# Altium schematic sheet Fatigue_V1.00.SchDoc
size A3
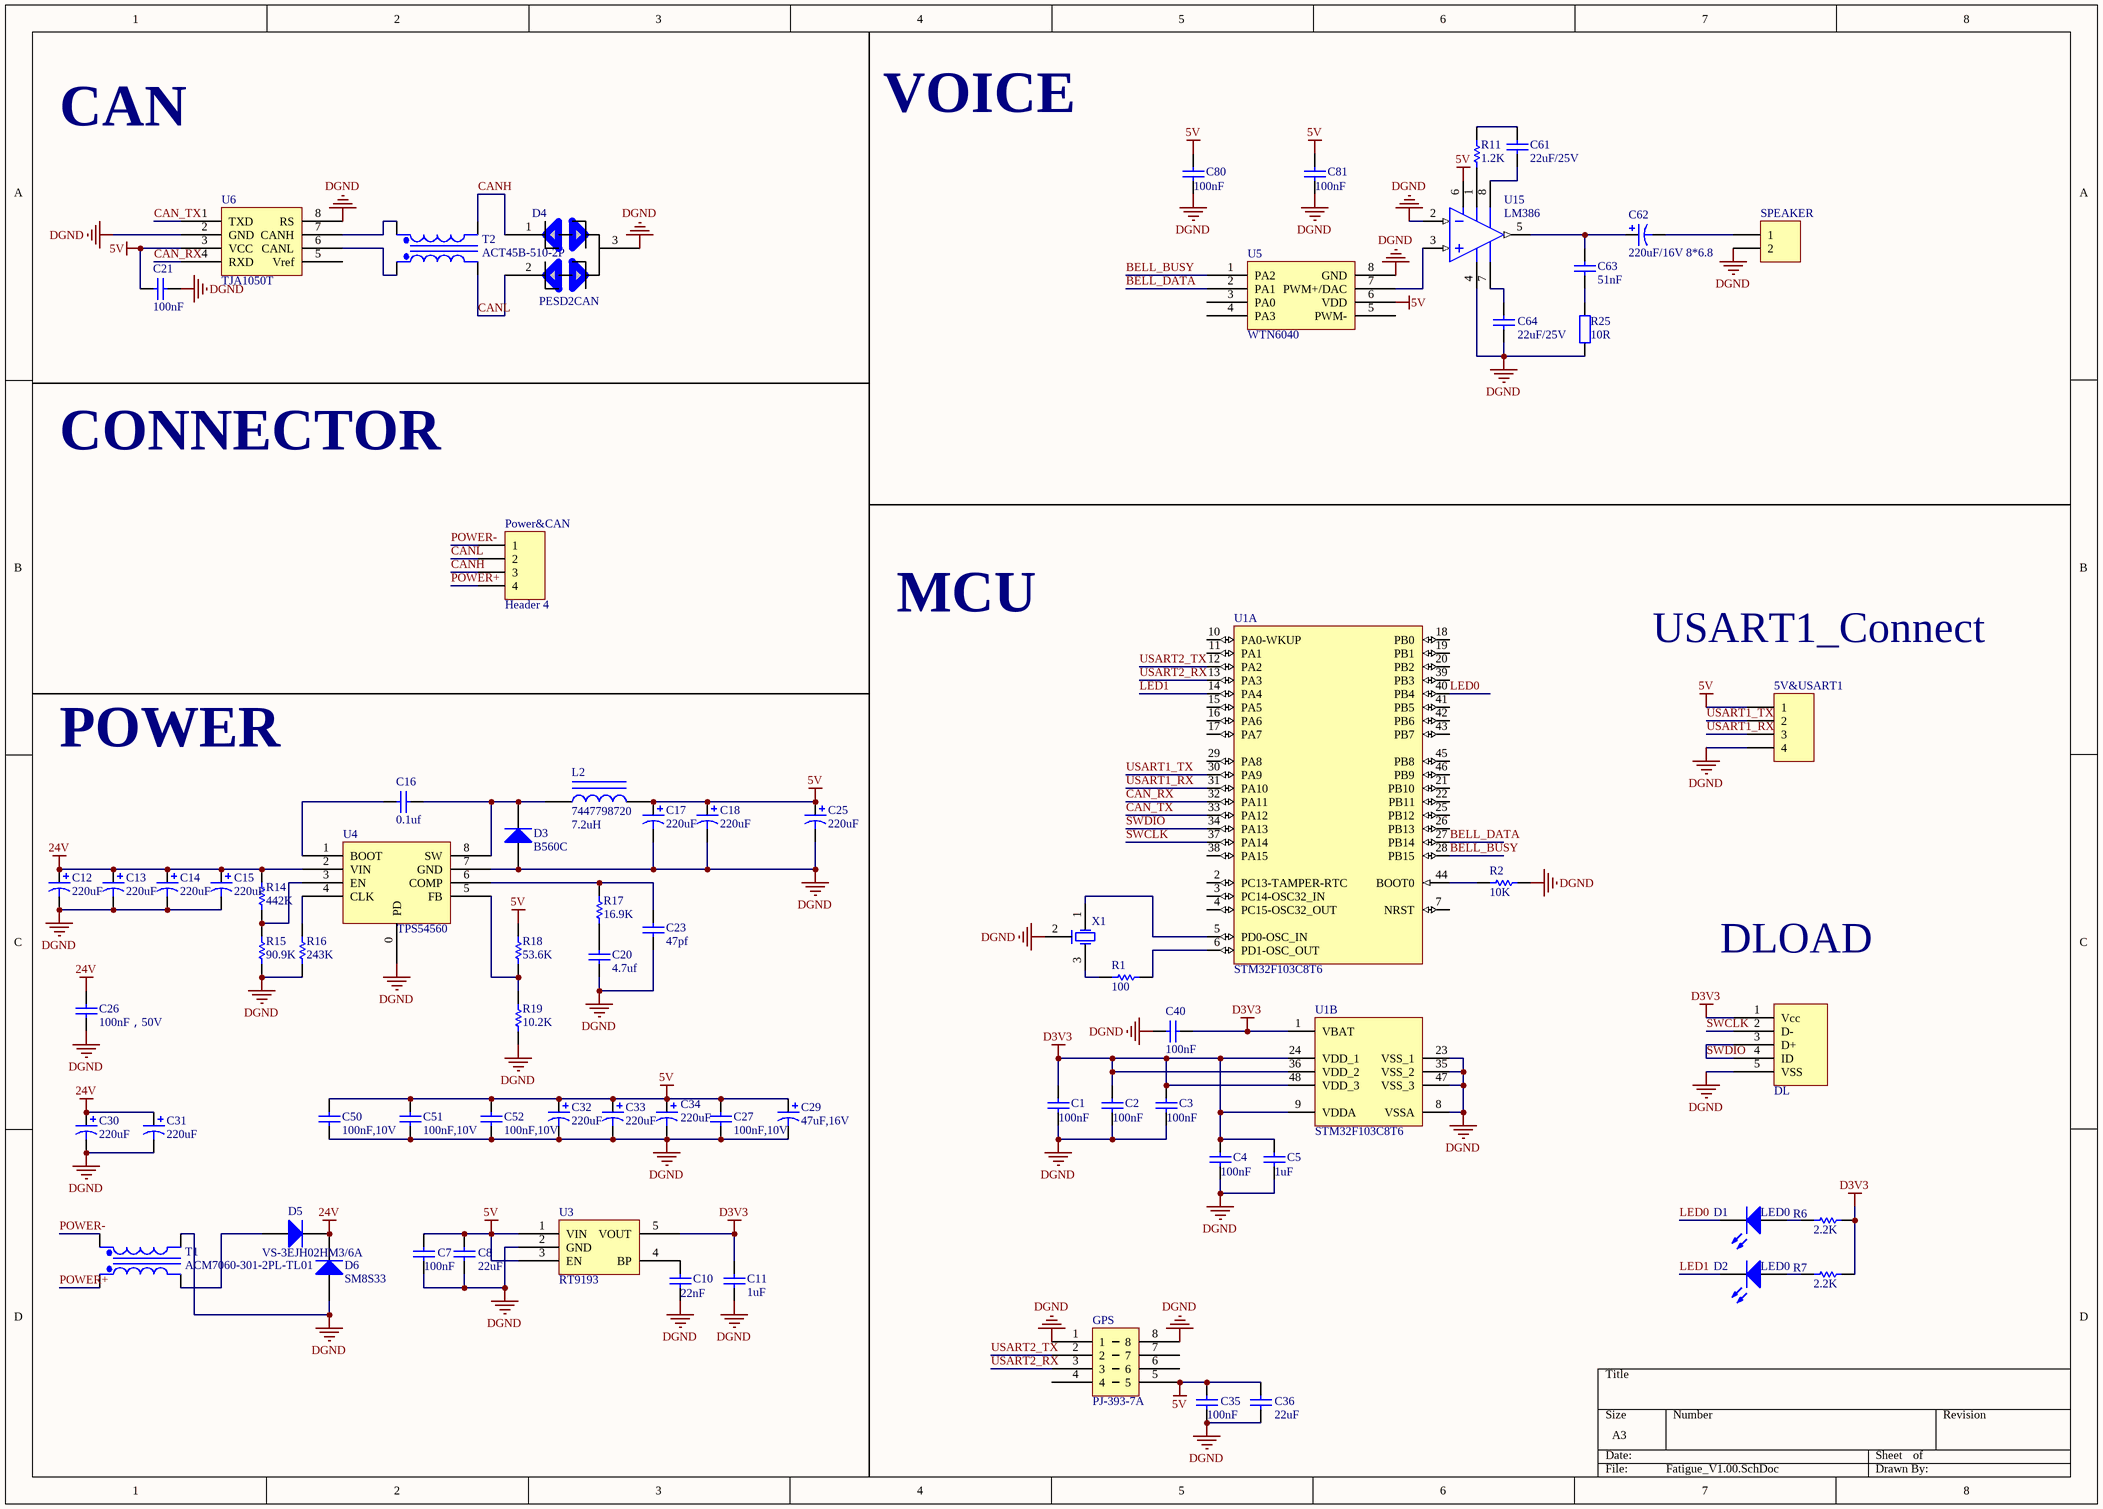
[diagram p0: Fatigue_V1.00.SchDoc]

## Parts
5V&USART1  TEST_USART2  [HDR1X4]  (value not drawn)
C1  100nF  [0402]
C2  100nF  [0402]
C3  100nF  [0402]
C4  100nF  [0402]
C5  1uF  [0603]
C7  100nF  [0402]
C8  22uF  [0805]
C10  22nF  [0402]
C11  1uF  [0603]
C12  220uF  [cap_pol_8*10.2]
C13  220uF  [cap_pol_8*10.2]
C14  220uF  [cap_pol_8*10.2]
C15  220uF  [cap_pol_8*10.2]
C16  0.1uf  [0603]
C17  220uF  [cap_pol_8*10.2]
C18  220uF  [cap_pol_8*10.2]
C20  4.7uf  [0603]
C21  100nF  [0402]
C23  47pf  [0603]
C25  220uF  [cap_pol_8*10.2]
C26  100nF，50V  [0603]
C27  100nF,10V  [0402]
C29  47uF,16V  [6032_pol]
C30  220uF  [cap_pol_8*10.2]
C31  220uF  [cap_pol_8*10.2]
C32  220uF  [cap_pol_8*10.2]
C33  220uF  [cap_pol_8*10.2]
C34  220uF  [cap_pol_8*10.2]
C35  100nF  [0402]
C36  22uF  [0805]
C40  100nF  [0402]
C50  100nF,10V  [0402]
C51  100nF,10V  [0402]
C52  100nF,10V  [0402]
C61  22uF/25V  [0805]
C62  220uF/16V 8*6.8  [cap_pol_8*10.2]
C63  51nF  [0402]
C64  22uF/25V  [0805]
C80  100nF  [0402]
C81  100nF  [0402]
D1  LED0  [1206_LED]
D2  LED0  [1206_LED]
D3  B560C  [SMC]
D4  PESD2CAN  [SOT23]
D5  VS-3EJH02HM3/6A  [B290]
D6  SM8S33  [SM8S]
DL  USB_5pin  [USBmicro_B]  (value not drawn)
GPS  PJ-393-7A  [3.5mm earphone slot]
L2  7447798720  value 7.2uH  [1064]
Power&CAN  Header 4  [HDR1X4]
R1  100  [0402]
R2  10K  [0402]
R6  2.2K  [0402]
R7  2.2K  [0402]
R11  1.2K  [0402]
R14  442K  [0603]
R15  90.9K  [0603]
R16  243K  [0603]
R17  16.9K  [0603]
R18  53.6K  [0603]
R19  10.2K  [0603]
R25  10R  [0402]
SPEAKER  SPEAKER  [HDR1X2]  (value not drawn)
T1  ACM7060-301-2PL-TL01  [ACM7060-301-2P-TL01]
T2  ACT45B-510-2P  [ACT45B-510-2P]
U1  STM32F103C8T6  [STM-LQFP48_N]  (parts A,B of 2)
U3  RT9193  [SOT-23-5]
U4  TPS54560  [HSOIC_8]
U5  WTN6040  [SO8]
U6  TJA1050T  [SO8]
U15  LM386  [SO8]
X1  8M smd  [8M]  (value not drawn)

## Nets
5V: 5V&USART1.1 C7.2 C8.2 C17.1 C18.1 C21.1 C25.1 C27.1 C29.1 C32.1 C33.1 C34.1 C35.2 C36.2 C50.1 C51.1 C52.1 C80.2 C81.2 GPS.5 L2.2 R18.2 U3.1(VIN) U3.3(EN) U5.6(VDD) U6.3(VCC) U15.6(OS_NUL)
24V: C12.1 C13.1 C14.1 C15.1 C26.1 C30.1 C31.1 D5.2(K) D6.2(K) R14.2 U4.2(VIN)
D3V3: C1.2 C2.2 C3.2 C4.2 C5.2 C11.2 C40.1 DL.1(Vcc) R6.1 R7.1 U1.1(VBAT) U1.9(VDDA) U1.24(VDD_1) U1.36(VDD_2) U1.48(VDD_3) U3.5(VOUT)
DGND: 5V&USART1.4 C1.1 C2.1 C3.1 C4.1 C5.1 C7.1 C8.1 C10.1 C11.1 C12.2 C13.2 C14.2 C15.2 C17.2 C18.2 C20.2 C21.2 C23.2 C25.2 C26.2 C27.2 C29.2 C30.2 C31.2 C32.2 C33.2 C34.2 C35.1 C36.1 C40.2 C50.2 C51.2 C52.2 C64.1 C80.1 C81.1 D3.1(A) D4.3 D6.1(A) DL.5(VSS) GPS.1 GPS.8 R2.2 R15.1 R16.1 R19.1 R25.1 SPEAKER.2 T1.4(Sec-) U1.8(VSSA) U1.23(VSS_1) U1.35(VSS_2) U1.47(VSS_3) U3.2(GND) U4.0(PD) U4.7(GND) U5.8(GND) U6.2(GND) U6.8(RS) U15.2(IN-) U15.4(V+) X1.2(GND)
BELL_BUSY: U1.28(PB15) U5.1(PA2)
BELL_DATA: U1.27(PB14) U5.2(PA1)
CAN_RX: U1.32(PA11) U6.4(RXD)
CAN_TX: U1.33(PA12) U6.1(TXD)
CANH: D4.1 Power&CAN.3 T2.4(Sec-)
CANL: D4.2 Power&CAN.2 T2.2(Pri-)
LED0: D1.2(K) U1.40(PB4)
LED1: D2.2(K) U1.14(PA4)
POWER+: Power&CAN.4 T1.1(Pri+)
POWER-: Power&CAN.1 T1.3(Sec+)
SWCLK: DL.2(D-) U1.37(PA14)
SWDIO: DL.3(D+) DL.4(ID) U1.34(PA13)
USART1_RX: 5V&USART1.3 U1.31(PA10)
USART1_TX: 5V&USART1.2 U1.30(PA9)
USART2_RX: GPS.3 U1.13(PA3)
USART2_TX: GPS.2 U1.12(PA2)
NetC10_2: C10.2 U3.4(BP)
NetC16_1: C16.1 D3.2(K) L2.1 U4.8(SW)
NetC16_2: C16.2 U4.1(BOOT)
NetC20_1: C20.1 R17.1
NetC23_1: C23.1 R17.2 U4.6(COMP)
NetC61_1: C61.1 R11.1
NetC61_2: C61.2 U15.8(OS_NUL)
NetC62_1: C62.1 C63.1 U15.5(OUT)
NetC62_2: C62.2 SPEAKER.1
NetC63_2: C63.2 R25.2
NetC64_2: C64.2 U15.7(TAB)
NetD1_1: D1.1(A) R6.2
NetD2_1: D2.1(A) R7.2
NetD5_1: D5.1(A) T1.2(Pri-)
NetR1_1: R1.1 X1.3(OSC2)
NetR1_2: R1.2 U1.6(PD1-OSC_OUT)
NetR2_1: R2.1 U1.44(BOOT0)
NetR11_2: R11.2 U15.1(V-)
NetR14_1: R14.1 R15.2 U4.3(EN)
NetR16_2: R16.2 U4.4(CLK)
NetR18_1: R18.1 R19.2 U4.5(FB)
NetT2_1: T2.1(Pri+) U6.6(CANL)
NetT2_3: T2.3(Sec+) U6.7(CANH)
NetU1_5: U1.5(PD0-OSC_IN) X1.1(OSC1)
NetU5_7: U5.7(PWM+/DAC) U15.3(IN+)

Not connected (* = marked no-connect by the designer): GPS 4 6 7; U1 2(PC13-TAMPER-RTC) 3(PC14-OSC32_IN) 4(PC15-OSC32_OUT) 7(NRST) 10(PA0-WKUP) 11(PA1) 15(PA5) 16(PA6) 17(PA7) 18(PB0) 19(PB1) 20(PB2) 21(PB10) 22(PB11) 25(PB12) 26(PB13) 29(PA8) 38(PA15) 39(PB3) 41(PB5) 42(PB6) 43(PB7) 45(PB8) 46(PB9); U5 3(PA0) 4(PA3) 5(PWM-); U6 5(Vref)

## Notes on the sheet
- CAN
- VOICE
- CONNECTOR
- MCU
- USART1_Connect
- POWER
- DLOAD

## Library data of the parts
5V&USART1 Power&CAN = Header 4: Header, 4-Pin; LatestRevisionDate: 17-Jul-2002; LatestRevisionNote: Re-released for DXP Platform.; Publisher: Altium Limited
C1-C5 C8 C10 C11 C16 C20 C21 C23 C36 C40 C80 C81 = Cap: Capacitor; Published: 8-Jun-2000; LatestRevisionDate: 17-Jul-2002; LatestRevisionNote: Re-released for DXP Platform.; PackageReference: RAD-0.3; Publisher: Altium Limited; PackageDescription: Radial Cap, Thru-Hole; 2 Leads; 0.3 in Pin Spacing
  C1-C4 C21 C40 C80 C81: Value: 100nF
  C5 C11: Value: 1uF
  C8 C36: Value: 22uF
  C10: Value: 22nF
  C16: Value: 0.1uF
  C20: Value: 4.7uF
  C23: Value: 47pF
C7 C35 = Cap: Capacitor,100V; Published: 8-Jun-2000; LatestRevisionDate: 17-Jul-2002; LatestRevisionNote: Re-released for DXP Platform.; PackageReference: RAD-0.3; Publisher: Altium Limited; PackageDescription: Radial Cap, Thru-Hole; 2 Leads; 0.3 in Pin Spacing; Value: 100nF
C12-C15 C17 C18 C25 C30-C34 = Cap Pol1: Polarized Capacitor (Radial); Value: 47uF; Published: 8-Jun-2000; LatestRevisionDate: 17-Jul-2002; LatestRevisionNote: Re-released for DXP Platform.; PackageReference: RB7.6-15; Publisher: Altium Limited; PackageDescription: Polarized Capacitor (Radial); 2 Leads
C26 C27 C50-C52 = Cap: Capacitor; Value: 4.7uF; Published: 8-Jun-2000; LatestRevisionDate: 17-Jul-2002; LatestRevisionNote: Re-released for DXP Platform.; PackageReference: RAD-0.3; Publisher: Altium Limited; PackageDescription: Radial Cap, Thru-Hole; 2 Leads; 0.3 in Pin Spacing
C29 = Cap Pol1: Polarized Capacitor (Radial); Published: 8-Jun-2000; LatestRevisionDate: 17-Jul-2002; LatestRevisionNote: Re-released for DXP Platform.; PackageReference: RB7.6-15; Publisher: Altium Limited; PackageDescription: Polarized Capacitor (Radial); 2 Leads; Value: 47uF
C61 C64 = Cap: Capacitor; Value: 22uF; Published: 8-Jun-2000; LatestRevisionDate: 17-Jul-2002; LatestRevisionNote: Re-released for DXP Platform.; PackageReference: RAD-0.3; Publisher: Altium Limited; PackageDescription: Radial Cap, Thru-Hole; 2 Leads; 0.3 in Pin Spacing
C62 = Cap Pol1: Polarized Capacitor (Radial); Value: 220uF/25V; Published: 8-Jun-2000; LatestRevisionDate: 17-Jul-2002; LatestRevisionNote: Re-released for DXP Platform.; PackageReference: RB7.6-15; Publisher: Altium Limited; PackageDescription: Polarized Capacitor (Radial); 2 Leads
C63 = Cap: Capacitor; Value: 47nF; Published: 8-Jun-2000; LatestRevisionDate: 17-Jul-2002; LatestRevisionNote: Re-released for DXP Platform.; PackageReference: RAD-0.3; Publisher: Altium Limited; PackageDescription: Radial Cap, Thru-Hole; 2 Leads; 0.3 in Pin Spacing
D1 D2 = LED0: green LED; Published: 8-Jun-2000; LatestRevisionDate: 08-Jul-2005; LatestRevisionNote: Mech Layer 1 removed.; PackageReference: LED-0; Publisher: Altium Limited; PackageDescription: LED; 2 Leads
D3 D6 = Diode 1N4007: 1 Amp General Purpose Rectifier; Published: 8-Jun-2000; LatestRevisionDate: 17-Jul-2002; LatestRevisionNote: Re-released for DXP Platform.; DatasheetVersion: 1998; PackageVersion: Aug-1999; PackageReference: DO-41; Publisher: Altium Limited; PackageDescription: Diode, Axial; Body 5.2 x 2.7 mm (LxDia. max), Lead Dia. 0.86 mm (max); Code_JEDEC: DO-204-AL; ComponentLink1Description: Manufacturer Link; ComponentLink1URL: http://www.fairchildsemi.com/; ComponentLink2Description: Datasheet; ComponentLink2URL: http://www.fairchildsemi.com/ds/1N%2F1N4001.pdf
D4 = PESD1CAN
D5 = Diode 1N4007: 1 Amp General Purpose Rectifier; pin to pad: 1>2 2>1; Published: 8-Jun-2000; LatestRevisionDate: 17-Jul-2002; LatestRevisionNote: Re-released for DXP Platform.; DatasheetVersion: 1998; PackageVersion: Aug-1999; PackageReference: DO-41; Publisher: Altium Limited; PackageDescription: Diode, Axial; Body 5.2 x 2.7 mm (LxDia. max), Lead Dia. 0.86 mm (max); Code_JEDEC: DO-204-AL; ComponentLink1Description: Manufacturer Link; ComponentLink1URL: http://www.fairchildsemi.com/; ComponentLink2Description: Datasheet; ComponentLink2URL: http://www.fairchildsemi.com/ds/1N%2F1N4001.pdf
GPS = 3.5mm earphone slot
L2 = Inductor Iron: Magnetic-Core Inductor; Published: 24-Mar-1999; LatestRevisionDate: 17-Jul-2002; LatestRevisionNote: Re-released for DXP Platform.; PackageReference: AXIAL-0.9; Publisher: Altium Limited; PackageDescription: Axial Device, Thru-Hole; 2 Leads; 0.9 in Pin Spacing
R1 R2 R6 R7 R14-R19 = Res1: Resistor; Published: 8-Jun-2000; LatestRevisionDate: 17-Jul-2002; LatestRevisionNote: Re-released for DXP Platform.; PackageReference: AXIAL-0.3; Publisher: Altium Limited
  R1: PackageDescription: Axial Device, Thru-Hole; 2 Leads; 0.3 in Pin Spacing; Value: 100
  R2: PackageDescription: Axial Device, Thru-Hole; 2 Leads; 0.3 in Pin Spacing; Value: 10K
  R6 R7: Value: 2.2K
  R14: PackageDescription: Axial Device, Thru-Hole; 2 Leads; 0.3 in Pin Spacing; Value: 442K
  R15: PackageDescription: Axial Device, Thru-Hole; 2 Leads; 0.3 in Pin Spacing; Value: 90.9K
  R16: PackageDescription: Axial Device, Thru-Hole; 2 Leads; 0.3 in Pin Spacing; Value: 243K
  R17: PackageDescription: Axial Device, Thru-Hole; 2 Leads; 0.3 in Pin Spacing; Value: 16.9K
  R18: PackageDescription: Axial Device, Thru-Hole; 2 Leads; 0.3 in Pin Spacing; Value: 53.6K
  R19: PackageDescription: Axial Device, Thru-Hole; 2 Leads; 0.3 in Pin Spacing; Value: 10.2K
R11 = Res Semi: Semiconductor Resistor; Published: 8-Jun-2000; LatestRevisionDate: 17-Jul-2002; LatestRevisionNote: Re-released for DXP Platform.; PackageReference: AXIAL-0.5; Publisher: Altium Limited; PackageDescription: Axial Device, Thru-Hole; 2 Leads; 0.5 in Pin Spacing; Value: 1.2K
R25 = Res2: Resistor; Value: 10; Published: 8-Jun-2000; LatestRevisionDate: 17-Jul-2002; LatestRevisionNote: Re-released for DXP Platform.; PackageReference: AXIAL-0.4; Publisher: Altium Limited; PackageDescription: Axial Device, Thru-Hole; 2 Leads; 0.4 in Pin Spacing
SPEAKER = Header 2: Header, 2-Pin; LatestRevisionDate: 17-Jul-2002; LatestRevisionNote: Re-released for DXP Platform.; Publisher: Altium Limited
T1 T2 = Trans Eq: Transformer (Equivalent Circuit Model); Published: 8-Jun-2000; LatestRevisionDate: 17-Jul-2002; LatestRevisionNote: Re-released for DXP Platform.; PackageReference: TRF_4; Publisher: Altium Limited; PackageDescription: Transformer; 4 Leads
U1 = STM32F103C8T6: ARM Cortex-M3 32-bit MCU, 64 KB Flash, 20 KB Internal RAM, 37 I/Os, 48-pin LQFP, -40 to 85 degC, Tray; A/D Converter: 2x12-bit (10 Channel); FLASH Size (Prog) (kB): 64; I/Os (High Current): 37; Internal RAM Size (kB): 20; Operating Frequency(F) (Processor speed) (MHz): 72; Supply Voltage(Vcc) min (V): 2; DatasheetVersion: Rev. 16; PackageVersion: Rev. 6, 06/2013; PackageReference: LQFP48; PackageDescription: 48-Pin Low Profile Quad Flat Package, 7 x 7 mm Body, 0.5 mm Pitch; Supplier 1: Digi-Key; Supplier Part Number 1: 497-6063-ND; Supplier 2: Farnell; Supplier Part Number 2: 1447637; Supplier 3: Newark; Supplier Part Number 3: 59M2182; Supplier 4: Newark; Supplier Part Number 4: 57P1222; Supplier 5: Mouser; Supplier Part Number 5: 511-STM32F103C8T6; Core: ARM Cortex-M3; Packing: Tray; Mounting Technology: Surface Mount; PartNumber: STM32F103C8T6; ComponentLink1Description: Manufacturer URL; ComponentLink1URL: http://www.st.com/web/en/home.html; ComponentLink2Description: Datasheet; ComponentLink2URL: http://www.st.com/st-web-ui/static/active/en/resource/technical/document/datasheet/CD00161566.pdf; ComponentLink3Description: Package Specification; ComponentLink3URL: http://www.st.com/st-web-ui/static/active/en/resource/technical/document/datasheet/DM00058181.pdf
U6 = TJA1050T: CAN Tranceiver
U15 = LM386_1